# Altium project PCB_Project1.PrjPCB
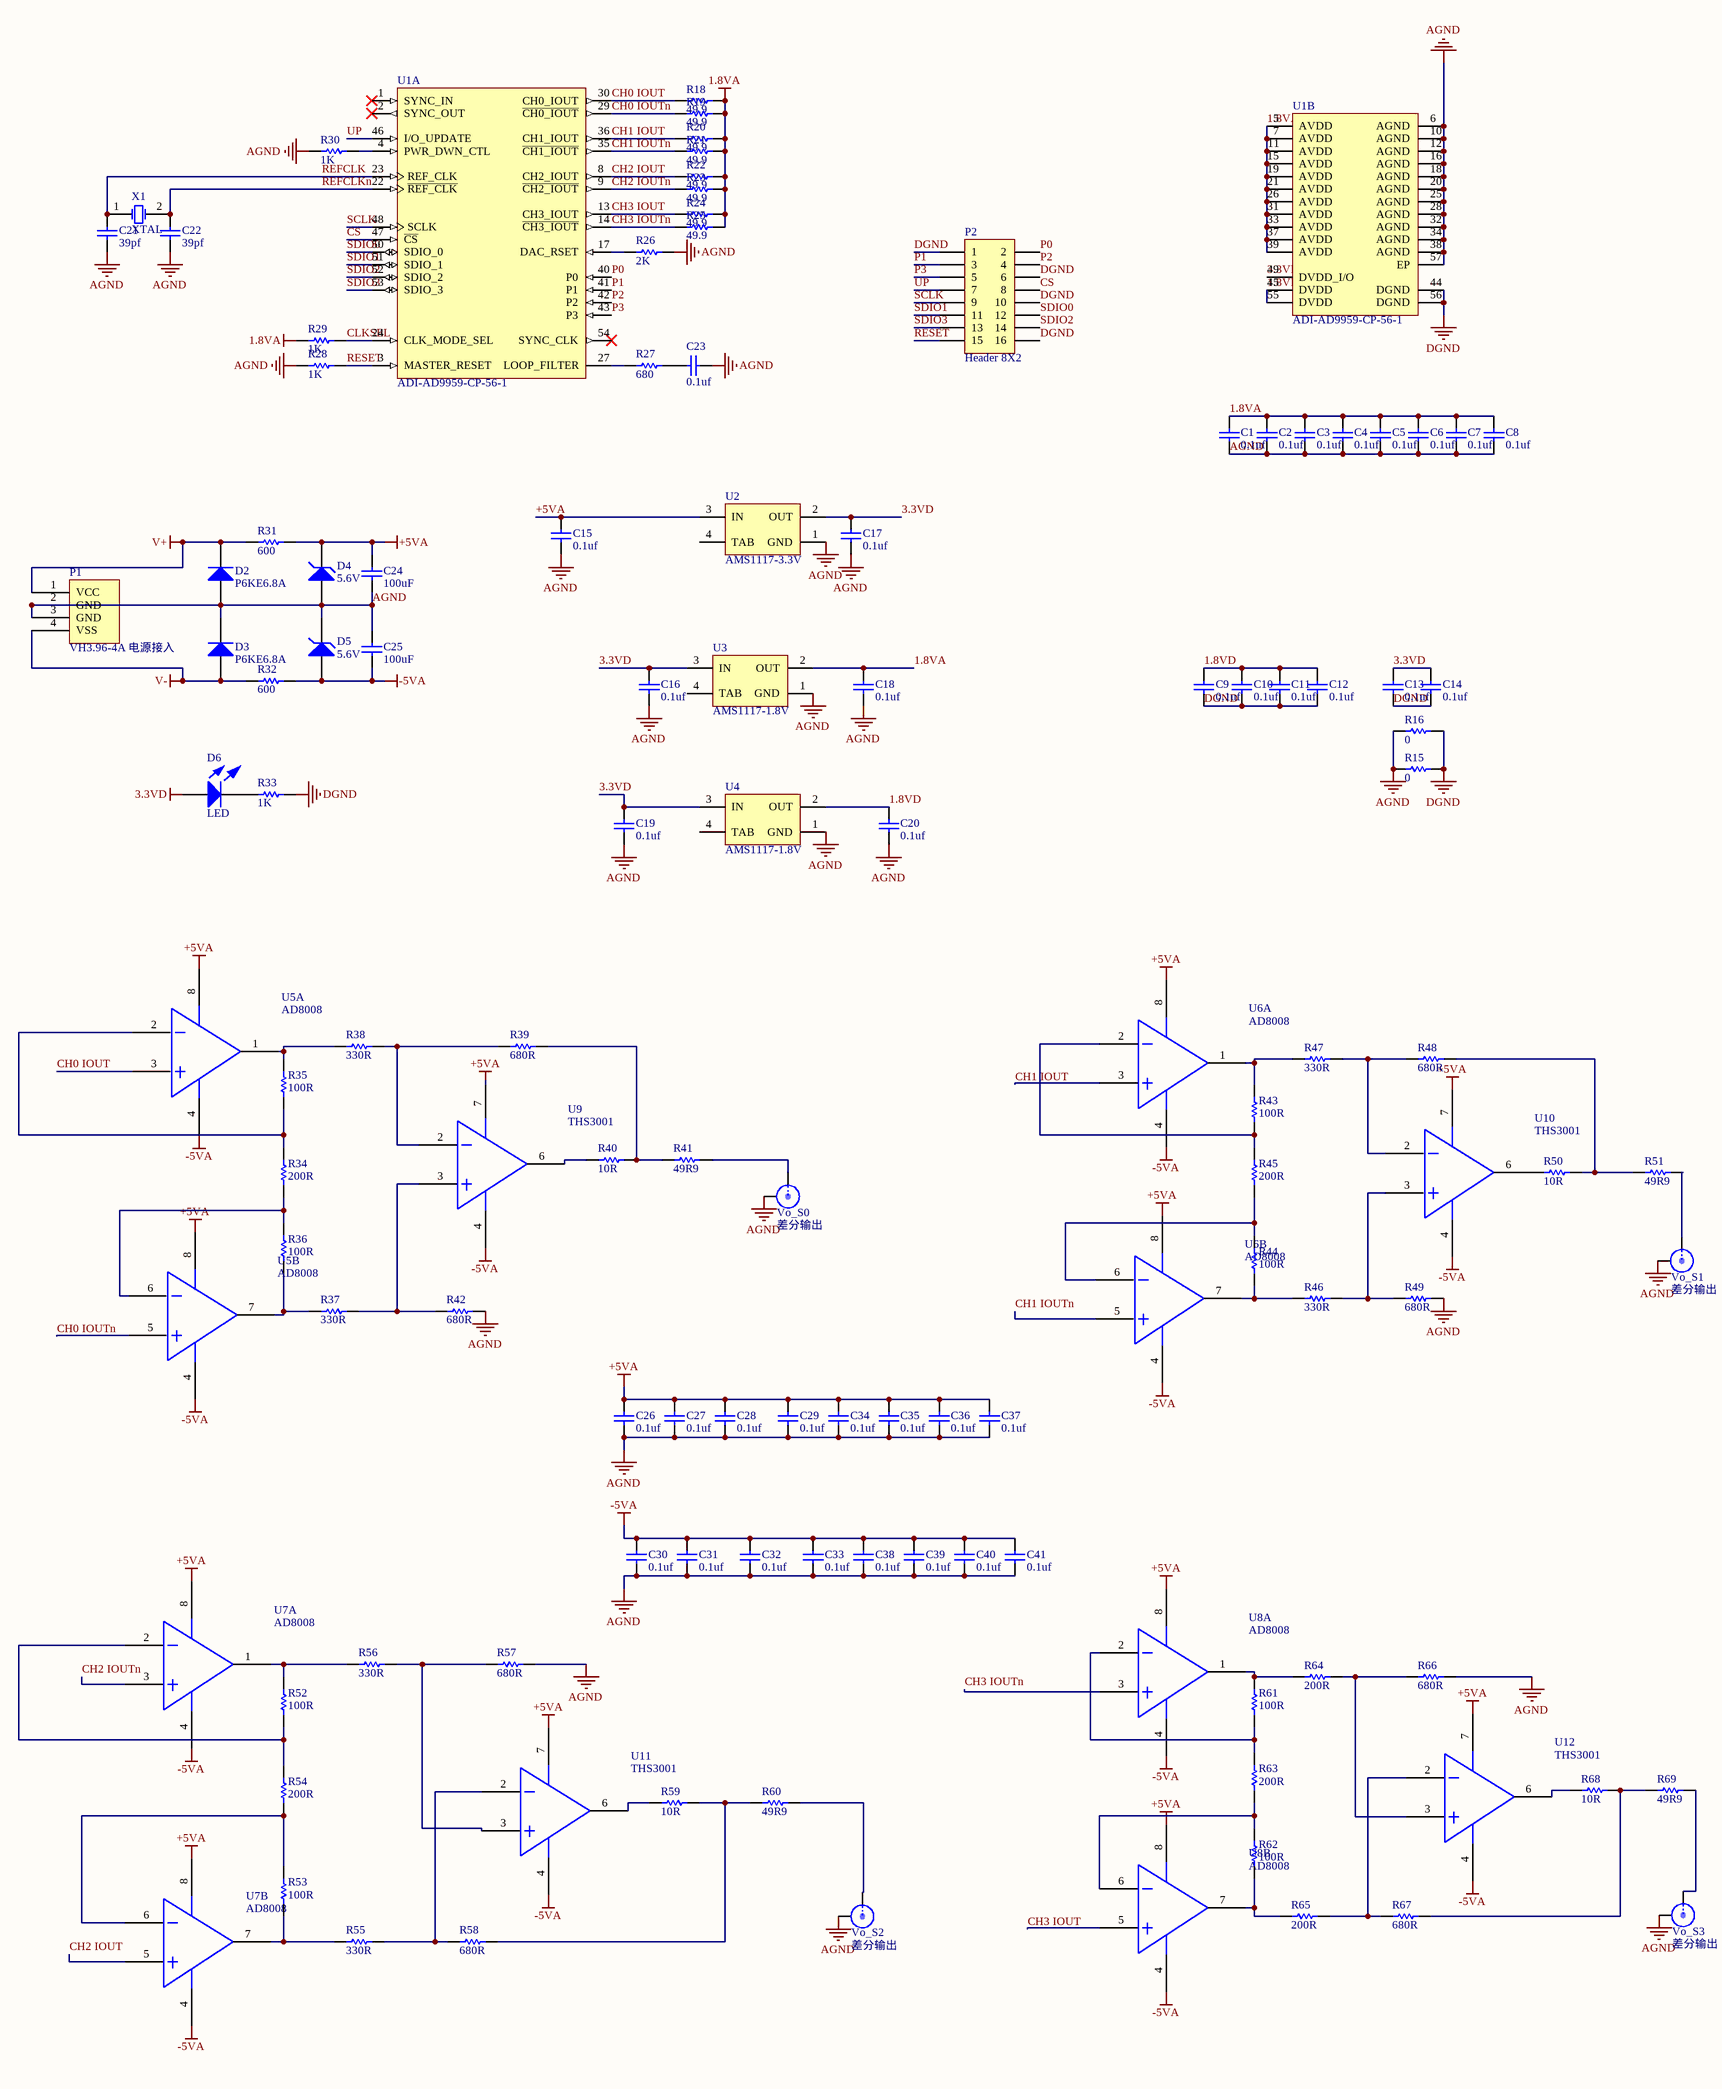
[diagram p0: Sheet1.SchDoc]
1 sheet, 119 parts. Net scope: global (net labels, ports and power ports of the same name join across sheets).
Board file: PCB1.PcbDoc

## Sheet Sheet1.SchDoc
size 381 x 508 mm

### Parts
C1  0.1uf  [0805]
C2  0.1uf  [0805]
C3  0.1uf  [0805]
C4  0.1uf  [0805]
C5  0.1uf  [0805]
C6  0.1uf  [0805]
C7  0.1uf  [0805]
C8  0.1uf  [0805]
C9  0.1uf  [0805]
C10  0.1uf  [0805]
C11  0.1uf  [0805]
C12  0.1uf  [0805]
C13  0.1uf  [0805]
C14  0.1uf  [0805]
C15  0.1uf  [0805]
C16  0.1uf  [0805]
C17  0.1uf  [0805]
C18  0.1uf  [0805]
C19  0.1uf  [0805]
C20  0.1uf  [0805]
C21  39pf  [0805]
C22  39pf  [0805]
C23  0.1uf  [0805]
C24  100uF  [0805]
C25  100uF  [0805]
C26  0.1uf  [0805]
C27  0.1uf  [0805]
C28  0.1uf  [0805]
C29  0.1uf  [0805]
C30  0.1uf  [0805]
C31  0.1uf  [0805]
C32  0.1uf  [0805]
C33  0.1uf  [0805]
C34  0.1uf  [0805]
C35  0.1uf  [0805]
C36  0.1uf  [0805]
C37  0.1uf  [0805]
C38  0.1uf  [0805]
C39  0.1uf  [0805]
C40  0.1uf  [0805]
C41  0.1uf  [0805]
D2  P6KE6.8A  [SMA/DO-214AC]
D3  P6KE6.8A  [SMA/DO-214AC]
D4  5.6V  [SMA/DO-214AC]
D5  5.6V  [SMA/DO-214AC]
D6  LED  [0805]
P1  VH3.96-4A 电源接入  [VH3.96-4P]
P2  Header 8X2  [HDR2X8]
R15  0  [0805]
R16  0  [0805]
R18  49.9  [0805]
R19  49.9  [0805]
R20  49.9  [0805]
R21  49.9  [0805]
R22  49.9  [0805]
R23  49.9  [0805]
R24  49.9  [0805]
R25  49.9  [0805]
R26  2K  [0805]
R27  680  [0805]
R28  1K  [0805]
R29  1K  [0805]
R30  1K  [0805]
R31  600  [0805]
R32  600  [0805]
R33  1K  [0805]
R34  200R  [0805]
R35  100R  [0805]
R36  100R  [0805]
R37  330R  [0805]
R38  330R  [0805]
R39  680R  [0805]
R40  10R  [0805]
R41  49R9  [0805]
R42  680R  [0805]
R43  100R  [0805]
R44  100R  [0805]
R45  200R  [0805]
R46  330R  [0805]
R47  330R  [0805]
R48  680R  [0805]
R49  680R  [0805]
R50  10R  [0805]
R51  49R9  [0805]
R52  100R  [0805]
R53  100R  [0805]
R54  200R  [0805]
R55  330R  [0805]
R56  330R  [0805]
R57  680R  [0805]
R58  680R  [0805]
R59  10R  [0805]
R60  49R9  [0805]
R61  100R  [0805]
R62  100R  [0805]
R63  200R  [0805]
R64  200R  [0805]
R65  200R  [0805]
R66  680R  [0805]
R67  680R  [0805]
R68  10R  [0805]
R69  49R9  [0805]
U1  ADI-AD9959-CP-56-1  [ADI-CP-56-1_L]  (parts A,B of 2)
U2  AMS1117-3.3V  [SOT223]
U3  AMS1117-1.8V  [SOT223]
U4  AMS1117-1.8V  [SOT223]
U5  AD8008  [LC-SOIC-8_150mil]  (parts A,B of 2)
U6  AD8008  [LC-SOIC-8_150mil]  (parts A,B of 2)
U7  AD8008  [LC-SOIC-8_150mil]  (parts A,B of 2)
U8  AD8008  [LC-SOIC-8_150mil]  (parts A,B of 2)
U9  THS3001  [LC-SOIC-8_150mil]
U10  THS3001  [LC-SOIC-8_150mil]
U11  THS3001  [LC-SOIC-8_150mil]
U12  THS3001  [LC-SOIC-8_150mil]
Vo_S0  差分输出  [SMA-LYING]
Vo_S1  差分输出  [SMA-LYING]
Vo_S2  差分输出  [SMA-LYING]
Vo_S3  差分输出  [SMA-LYING]
X1  XTAL  [XAL HC-49S]

### Nets
1.8VA: C1.2 C2.2 C3.2 C4.2 C5.2 C6.2 C7.2 C8.2 C18.2 R18.2 R19.2 R20.2 R21.2 R22.2 R23.2 R24.2 R25.2 R29.1 U1.5(AVDD) U1.7(AVDD) U1.11(AVDD) U1.15(AVDD) U1.19(AVDD) U1.21(AVDD) U1.26(AVDD) U1.31(AVDD) U1.33(AVDD) U1.37(AVDD) U1.39(AVDD) U3.2(OUT)
3.3VD: C13.2 C14.2 C16.2 C17.2 C19.2 D6.1(A) U1.49(DVDD_I/O) U2.2(OUT) U3.3(IN) U4.3(IN)
+5VA: C15.2 C24.2 C26.2 C27.2 C28.2 C29.2 C34.2 C35.2 C36.2 C37.2 D4.2(K) R31.2 U2.3(IN) U5.8 U6.8 U7.8 U8.8 U9.7(IN-) U10.7(IN-) U11.7(IN-) U12.7(IN-)
-5VA: C25.2 C30.2 C31.2 C32.2 C33.2 C38.2 C39.2 C40.2 C41.2 D5.1(A) R32.2 U5.4(IN-) U6.4(IN-) U7.4(IN-) U8.4(IN-) U9.4(IN-) U10.4(IN-) U11.4(IN-) U12.4(IN-)
AGND: C1.1 C2.1 C3.1 C4.1 C5.1 C6.1 C7.1 C8.1 C15.1 C16.1 C17.1 C18.1 C19.1 C20.1 C21.1 C22.1 C23.2 C24.1 C25.1 C26.1 C27.1 C28.1 C29.1 C30.1 C31.1 C32.1 C33.1 C34.1 C35.1 C36.1 C37.1 C38.1 C39.1 C40.1 C41.1 D2.1(A) D3.2(K) D4.1(A) D5.2(K) P1.2(GND) P1.3(GND) R15.1 R16.1 R26.2 R28.1 R30.1 R42.2 R49.1 R57.1 R66.1 U1.6(AGND) U1.10(AGND) U1.12(AGND) U1.16(AGND) U1.18(AGND) U1.20(AGND) U1.25(AGND) U1.28(AGND) U1.32(AGND) U1.34(AGND) U1.38(AGND) U1.57(EP) U2.1(GND) U3.1(GND) U4.1(GND) Vo_S0.1 Vo_S1.1 Vo_S2.1 Vo_S3.1
DGND: C9.1 C10.1 C11.1 C12.1 C13.1 C14.1 P2.1 P2.6 P2.10 P2.16 R15.2 R16.2 R33.2 U1.44(DGND) U1.56(DGND)
V+: D2.2(K) P1.1(VCC) R31.1
V-: D3.1(A) P1.4(VSS) R32.1
1.8VD: C9.2 C10.2 C11.2 C12.2 C20.2 U1.45(DVDD) U1.55(DVDD) U4.2(OUT)
CH0 IOUT: R18.1 U1.30(CH0_IOUT) U5.3(IN-)
CH0 IOUTn: R19.1 U1.29(~{CH0_IOUT}) U5.5(IN-)
CH1 IOUT: R20.1 U1.36(CH1_IOUT) U6.3(IN-)
CH1 IOUTn: R21.1 U1.35(~{CH1_IOUT}) U6.5(IN-)
CH2 IOUT: R22.1 U1.8(CH2_IOUT) U7.5(IN-)
CH2 IOUTn: R23.1 U1.9(~{CH2_IOUT}) U7.3(IN-)
CH3 IOUT: R24.1 U1.13(CH3_IOUT) U8.5(IN-)
CH3 IOUTn: R25.1 U1.14(~{CH3_IOUT}) U8.3(IN-)
CLKSEL: R29.2 U1.24(CLK_MODE_SEL)
CS: P2.8 U1.47(~{CS})
P0: P2.2 U1.40(P0)
P1: P2.3 U1.41(P1)
P2: P2.4 U1.42(P2)
P3: P2.5 U1.43(P3)
REFCLK: C21.2 U1.23(REF_CLK) X1.1(OSC1)
REFCLKn: C22.2 U1.22(~{REF_CLK}) X1.2(OSC2)
RESET: P2.15 R28.2 U1.3(MASTER_RESET)
SCLK: P2.9 U1.48(SCLK)
SDIO0: P2.12 U1.50(SDIO_0)
SDIO1: P2.11 U1.51(SDIO_1)
SDIO2: P2.14 U1.52(SDIO_2)
SDIO3: P2.13 U1.53(SDIO_3)
UP: P2.7 U1.46(I/O_UPDATE)
NetC23_1: C23.1 R27.2
NetD6_2: D6.2(K) R33.1
NetR26_1: R26.1 U1.17(DAC_RSET)
NetR27_1: R27.1 U1.27(LOOP_FILTER)
NetR30_2: R30.2 U1.4(PWR_DWN_CTL)
NetR34_1: R34.1 R36.1 U5.6(IN-)
NetR34_2: R34.2 R35.2 U5.2(IN-)
NetR35_1: R35.1 R38.1 U5.1(IN-)
NetR36_2: R36.2 R37.1 U5.7(IN-)
NetR37_2: R37.2 R42.1 U9.3(IN-)
NetR38_2: R38.2 R39.1 U9.2(IN-)
NetR39_2: R39.2 R40.2 R41.1
NetR40_1: R40.1 U9.6(IN-)
NetR41_2: R41.2 Vo_S0.0
NetR43_1: R43.1 R45.2 U6.2(IN-)
NetR43_2: R43.2 R47.2 U6.1(IN-)
NetR44_1: R44.1 R46.2 U6.7(IN-)
NetR44_2: R44.2 R45.1 U6.6(IN-)
NetR46_1: R46.1 R49.2 U10.3(IN-)
NetR47_1: R47.1 R48.2 U10.2(IN-)
NetR48_1: R48.1 R50.1 R51.2
NetR50_2: R50.2 U10.6(IN-)
NetR51_1: R51.1 Vo_S1.0
NetR52_1: R52.1 R54.2 U7.2(IN-)
NetR52_2: R52.2 R56.2 U7.1(IN-)
NetR53_1: R53.1 R55.2 U7.7(IN-)
NetR53_2: R53.2 R54.1 U7.6(IN-)
NetR55_1: R55.1 R58.2 U11.2(IN-)
NetR56_1: R56.1 R57.2 U11.3(IN-)
NetR58_1: R58.1 R59.1 R60.2
NetR59_2: R59.2 U11.6(IN-)
NetR60_1: R60.1 Vo_S2.0
NetR61_1: R61.1 R63.2 U8.2(IN-)
NetR61_2: R61.2 R64.2 U8.1(IN-)
NetR62_1: R62.1 R65.2 U8.7(IN-)
NetR62_2: R62.2 R63.1 U8.6(IN-)
NetR64_1: R64.1 R66.2 U12.3(IN-)
NetR65_1: R65.1 R67.2 U12.2(IN-)
NetR67_1: R67.1 R68.1 R69.2
NetR68_2: R68.2 U12.6(IN-)
NetR69_1: R69.1 Vo_S3.0

Not connected (* = marked no-connect by the designer): U1 1(SYNC_IN)* 2(SYNC_OUT)* 54(SYNC_CLK)*; U2 4(TAB); U3 4(TAB); U4 4(TAB)

### Library data of the parts
C1-C23 C26-C41 = Cap
C24 C25 = CAP
D4 D5 = 肖特基-5.6V
P1 = VH3.96-4A
P2 = Header 8X2: Header, 8-Pin, Dual row; LatestRevisionDate: 17-Jul-2002; LatestRevisionNote: Re-released for DXP Platform.; Publisher: Altium Limited
R15 R16 R18-R69 = Res
Vo_S0-Vo_S3 = SMA
X1 = XTAL: Crystal Oscillator; Published: 8-Jun-2000; LatestRevisionDate: 17-Jul-2002; LatestRevisionNote: Re-released for DXP Platform.; PackageReference: R38; Publisher: Altium Limited; PackageDescription: Crystal, Thru-Hole; 2 Leads; Body 3.1 x 8.2 mm (Dia.xH)